# Altium project IO_AGV.PrjPcb
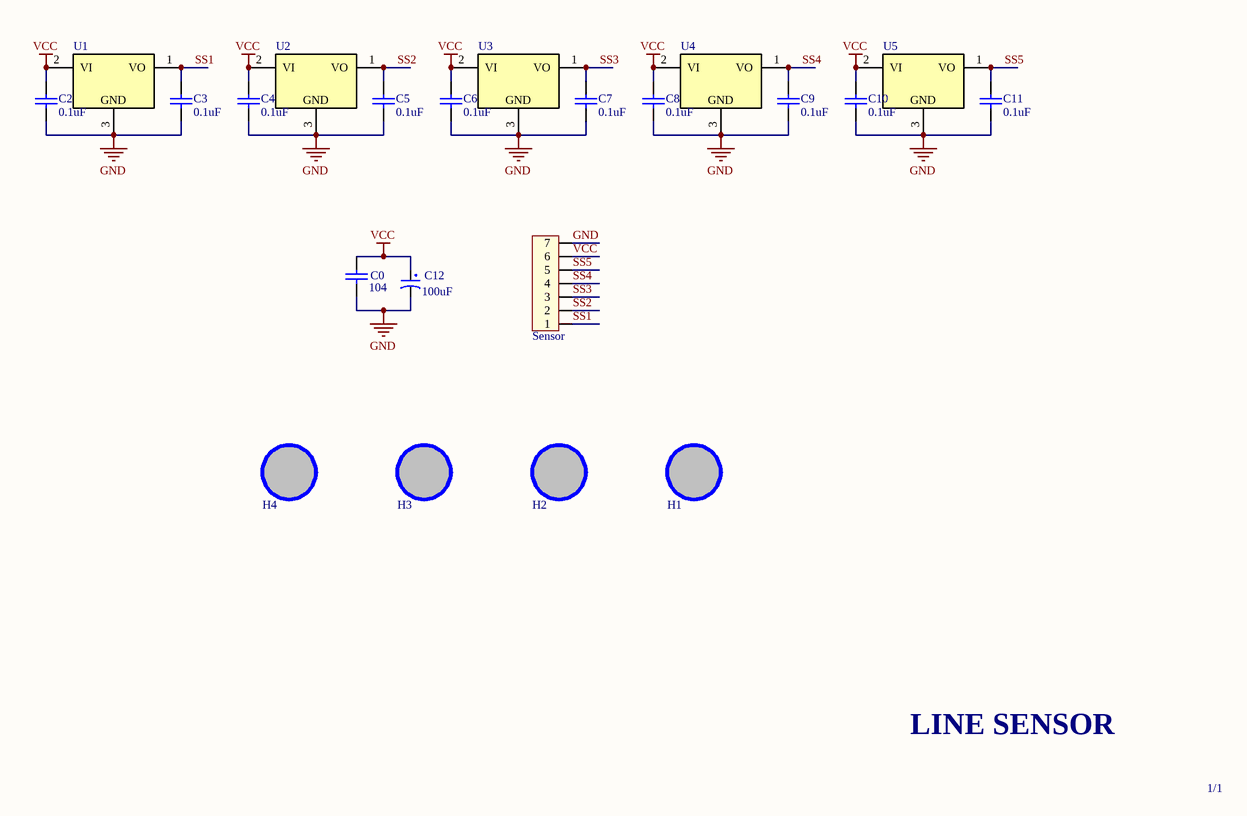
[diagram p0: IO_Hall_Sensor_SMD_Sch.SchDoc]
1 sheet, 22 parts. Net scope: global (net labels, ports and power ports of the same name join across sheets).
Board file: IO_Hall_Sensor_SMD_Pcb.PcbDoc

## Sheet IO_Hall_Sensor_SMD_Sch.SchDoc
size 297 x 209 mm; ENG_APP_DATE: --/--/--; DSN_APP_DATE: --/--/--; CHK_APP_DATE: --/--/--

### Parts
C0  104  [CAP-SM-0603]
C2  0.1uF  [CAP-SM-0603]
C3  0.1uF  [CAP-SM-0603]
C4  0.1uF  [CAP-SM-0603]
C5  0.1uF  [CAP-SM-0603]
C6  0.1uF  [CAP-SM-0603]
C7  0.1uF  [CAP-SM-0603]
C8  0.1uF  [CAP-SM-0603]
C9  0.1uF  [CAP-SM-0603]
C10  0.1uF  [CAP-SM-0603]
C11  0.1uF  [CAP-SM-0603]
C12  100uF  [tu tantalum smd3528]
H1  Hole  [LO KHOAN 3MM]  (value not drawn)
H2  Hole  [LO KHOAN 3MM]  (value not drawn)
H3  Hole  [LO KHOAN 3MM]  (value not drawn)
H4  Hole  [LO KHOAN 3MM]  (value not drawn)
Sensor  Sensor  [Header 7P DC 2.54]
U1  (no value)  [SOT 23-3]
U2  (no value)  [SOT 23-3]
U3  (no value)  [SOT 23-3]
U4  (no value)  [SOT 23-3]
U5  (no value)  [SOT 23-3]

### Nets
GND: C0.1 C2.2 C3.2 C4.2 C5.2 C6.2 C7.2 C8.2 C9.2 C10.2 C11.2 C12.2 Sensor.7 U1.3 U2.3 U3.3 U4.3 U5.3
VCC: C0.2 C2.1 C4.1 C6.1 C8.1 C10.1 C12.1 Sensor.6 U1.2(VI) U2.2(VI) U3.2(VI) U4.2(VI) U5.2(VI)
SS1: C3.1 Sensor.1 U1.1(VO)
SS2: C5.1 Sensor.2 U2.1(VO)
SS3: C7.1 Sensor.3 U3.1(VO)
SS4: C9.1 Sensor.4 U4.1(VO)
SS5: C11.1 Sensor.5 U5.1(VO)

Not connected (* = marked no-connect by the designer): H1 1; H2 1; H3 1; H4 1

### Notes on the sheet
- LINE SENSOR
- 1/1
- NGUYEN VAN SON
- (in symbol REG_30V-5V-100mA-1.4W-SOT23-3_2) GND

### Library data of the parts
C0 = Tu gom 104 50V: Cắm; So_Chan: 2; Ten_Linh_Kien: Tụ gốm 104 100nF 50V; Don_Vi: Con; Ma_Hang: MH004761; Chung_Loai: Cắm; Kieu_Chan: *
C2-C11 = Tu 0805 476 6.3V 20%: Dán; Don_Vi: Con; So_Chan: 2; Ten_Linh_Kien: Tụ 0805 476-47uF 20% 6.3V; Ma_Hang: MH004277; Chung_Loai: Dán; Kieu_Chan: *
C12 = Tu tantalum 100uF 50V SMD7343: Dán; Don_Vi: Con; So_Chan: 2; Ten_Linh_Kien: Tụ tantalum 107T-100uF 50V SMD7343; Ma_Hang: MH008401; Chung_Loai: Dán; Kieu_Chan: *
H1-H4 = Hole: Hole 3mm
Sensor = Header 7P 2.54 Duc Cong: Cắm; Ten_Linh_Kien: Header 7P XH2.54-7P Đực Cong; Don_Vi: Con; Ma_Hang: MH004118; Chung_Loai: Cắm
U1-U5 = REG_30V-5V-100mA-1.4W-SOT23-3_2: Linear Voltage Regulator IC 1 Output 100mA SOT-23-3; pin to pad: 1>2 2>1; Manufacturer: Texas Instruments; Manufacturer Part Number: LM3480IM3-5.0/NOPB; Alternate Part Number-1: NA; Case/Package: SOT23-3; Supplier-1: CATLOG COMPONENTS; Supplier Part Number-1: LM3480IM3-5.0/NOPB